# Altium project mppt-ng controlboard.PRJPCB
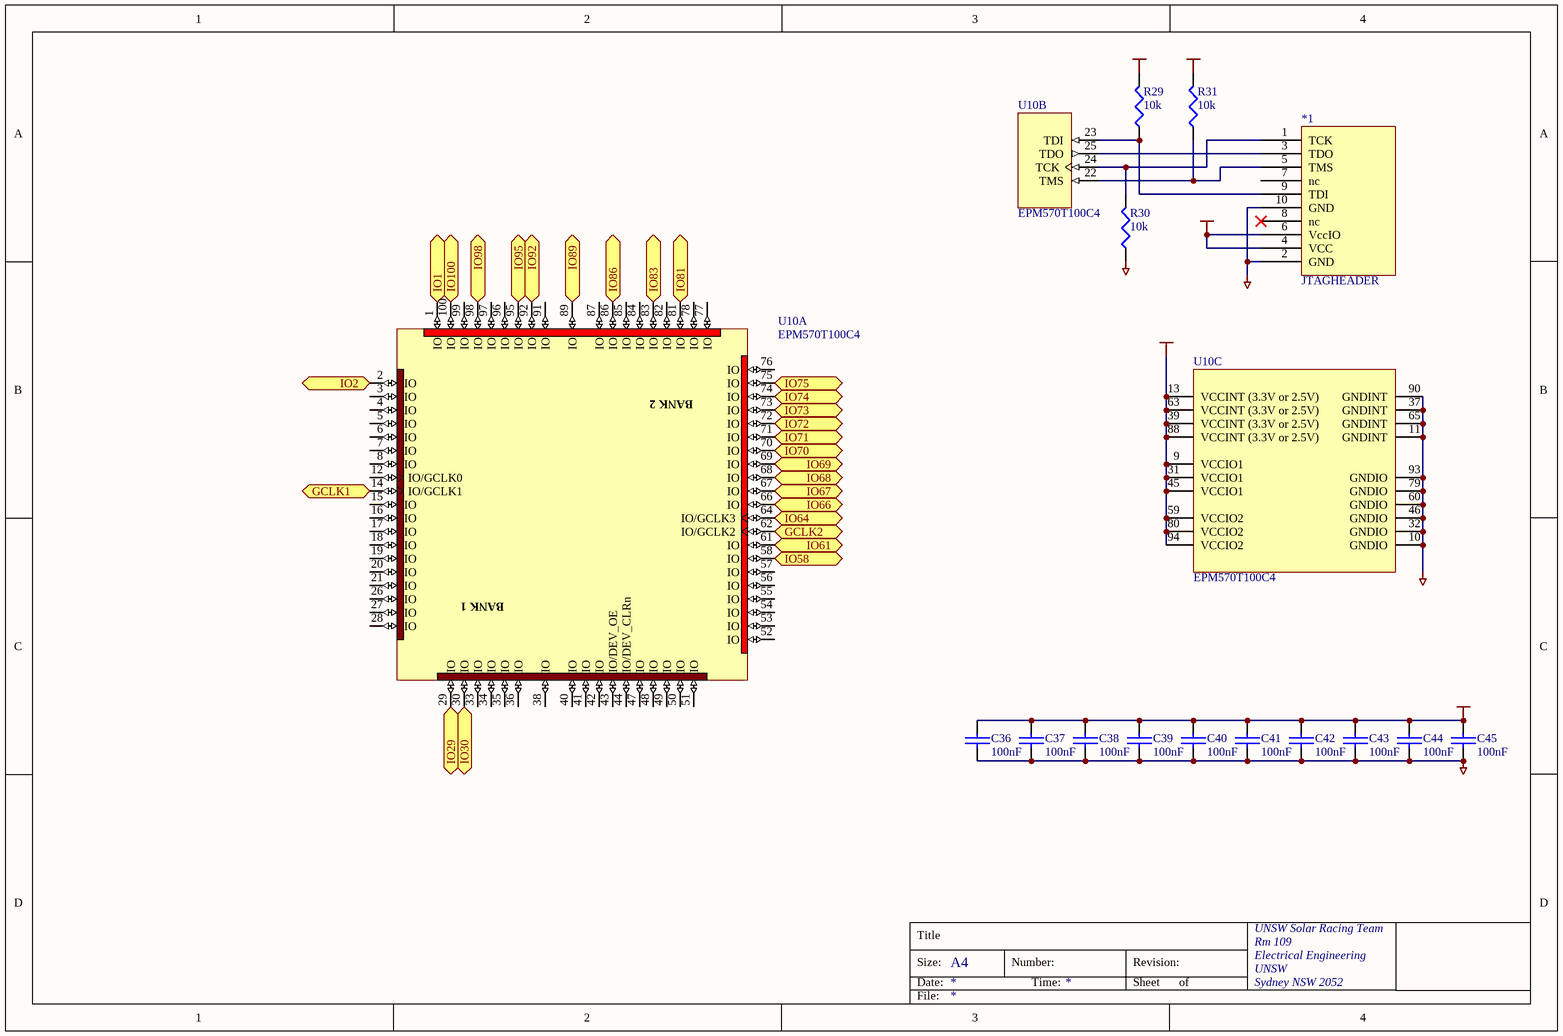
[diagram p0: MAXII.SCHDOC]
4 sheets, 61 parts. Net scope: hierarchical (ports join the sheet entries above them; power ports are global).
Board file: mppt-ng controlboard.PCBDOC
Sheets:
  MAXII.SCHDOC
  MSP430F149.SCHDOC
  3V3SwitchingRegulator.SchDoc
  3V3-CAN.SchDoc

## Sheet MAXII.SCHDOC
size A4; Organization: UNSW Solar Racing Team; Address3: UNSW; Address4: Sydney NSW 2052; Address2: Electrical Engineering; Address1: Rm 109

### Parts
*1  JTAGHEADER  [HDR2X5]
C36  100nF  [0603]
C37  100nF  [0603]
C38  100nF  [0603]
C39  100nF  [0603]
C40  100nF  [0603]
C41  100nF  [0603]
C42  100nF  [0603]
C43  100nF  [0603]
C44  100nF  [0603]
C45  100nF  [0603]
R29  10k  [0603]
R30  10k  [0603]
R31  10k  [0603]
U10  EPM570T100C4  [TQFP100]  (parts A,B,C of 3)

### Ports
GCLK1 (in), GCLK2 (in), IO1, IO2, IO29, IO30, IO58 (in), IO61, IO64 (in), IO66, IO67, IO68, IO69, IO70, IO71, IO72, IO73, IO74, IO75, IO81, IO83, IO86, IO89, IO92, IO95, IO98, IO100

### Nets
3V3: *1.4(VCC) *1.6(VccIO) C36.1 C37.1 C38.1 C39.1 C40.1 C41.1 C42.1 C43.1 C44.1 C45.1 R29.2 R31.2 U10.9(VCCIO1) U10.13(VCCINT_(3.3V_or_2.5V)) U10.31(VCCIO1) U10.39(VCCINT_(3.3V_or_2.5V)) U10.45(VCCIO1) U10.59(VCCIO2) U10.63(VCCINT_(3.3V_or_2.5V)) U10.80(VCCIO2) U10.88(VCCINT_(3.3V_or_2.5V)) U10.94(VCCIO2)
GND: *1.2(GND) *1.10(GND) C36.2 C37.2 C38.2 C39.2 C40.2 C41.2 C42.2 C43.2 C44.2 C45.2 R30.1 U10.10(GNDIO) U10.11(GNDINT) U10.32(GNDIO) U10.37(GNDINT) U10.46(GNDIO) U10.60(GNDIO) U10.65(GNDINT) U10.79(GNDIO) U10.90(GNDINT) U10.93(GNDIO)
Net*1_1: *1.1(TCK) R30.2 U10.24(TCK)
Net*1_3: *1.3(TDO) U10.25(TDO)
Net*1_5: *1.5(TMS) R31.1 U10.22(TMS)
Net*1_9: *1.9(TDI) R29.1 U10.23(TDI)
NetU10_1: U10.1(IO) ; port IO1
NetU10_2: U10.2(IO) ; port IO2
NetU10_14: U10.14(IO/GCLK1) ; port GCLK1
NetU10_29: U10.29(IO) ; port IO29
NetU10_30: U10.30(IO) ; port IO30
NetU10_58: U10.58(IO) ; port IO58
NetU10_61: U10.61(IO) ; port IO61
NetU10_62: U10.62(IO/GCLK2) ; port GCLK2
NetU10_64: U10.64(IO/GCLK3) ; port IO64
NetU10_66: U10.66(IO) ; port IO66
NetU10_67: U10.67(IO) ; port IO67
NetU10_68: U10.68(IO) ; port IO68
NetU10_69: U10.69(IO) ; port IO69
NetU10_70: U10.70(IO) ; port IO70
NetU10_71: U10.71(IO) ; port IO71
NetU10_72: U10.72(IO) ; port IO72
NetU10_73: U10.73(IO) ; port IO73
NetU10_74: U10.74(IO) ; port IO74
NetU10_75: U10.75(IO) ; port IO75
NetU10_81: U10.81(IO) ; port IO81
NetU10_83: U10.83(IO) ; port IO83
NetU10_86: U10.86(IO) ; port IO86
NetU10_89: U10.89(IO) ; port IO89
NetU10_92: U10.92(IO) ; port IO92
NetU10_95: U10.95(IO) ; port IO95
NetU10_98: U10.98(IO) ; port IO98
NetU10_100: U10.100(IO) ; port IO100

Not connected (* = marked no-connect by the designer): *1 7(nc) 8(nc)*; U10 3(IO) 4(IO) 5(IO) 6(IO) 7(IO) 8(IO) 12(IO/GCLK0) 15(IO) 16(IO) 17(IO) 18(IO) 19(IO) 20(IO) 21(IO) 26(IO) 27(IO) 28(IO) 33(IO) 34(IO) 35(IO) 36(IO) 38(IO) 40(IO) 41(IO) 42(IO) 43(IO/DEV_OE) 44(IO/DEV_CLRn) 47(IO) 48(IO) 49(IO) 50(IO) 51(IO) 52(IO) 53(IO) 54(IO) 55(IO) 56(IO) 57(IO) 76(IO) 77(IO) 78(IO) 82(IO) 84(IO) 85(IO) 87(IO) 91(IO) 96(IO) 97(IO) 99(IO)

### Notes on the sheet
- Title
- Size:
- Date:
- A4
- Number:
- Time:
- Revision:
- Sheet
- of
- File:
- (in symbol EPM570T100C4, part A) BANK 2; BANK 1

### Library data of the parts
C36-C45 = CAP: Capacitor; Farnell: 753-567; Price: 0.30
R29-R31 = RES1: Resistor; Farnell: 612-601; Price: 0.11
U10 = EPM570T100C4: MAX II 2.5/3.3V FPGA, 76 I/Os, 100-Pin Plastic TQFP, Commercial Temperature, Speed Grade 4; Note: Each set of VCCIO pins can be connected to 3.3V, 2.5V, 1.8V, or 1.5V.; Published: 15-Jul-2004; DatasheetDocument: ver1.1, Jun-2004; PackageDocument: Mar-2004; PackageReference: TQFP100; Publisher: Altium Limited; Code_JEDEC: MS-026-BDE; Code_IPC: SQFP14X14-100; Farnell: NA
*1 = JTAGHEADER: Farnell: 302-1439; Price: 2.19

## Sheet MSP430F149.SCHDOC
size A4; Organization: UNSW Solar Racing Team; Address3: UNSW; Address4: Sydney NSW 2052; Address2: Electrical Engineering; Address1: Rm 109
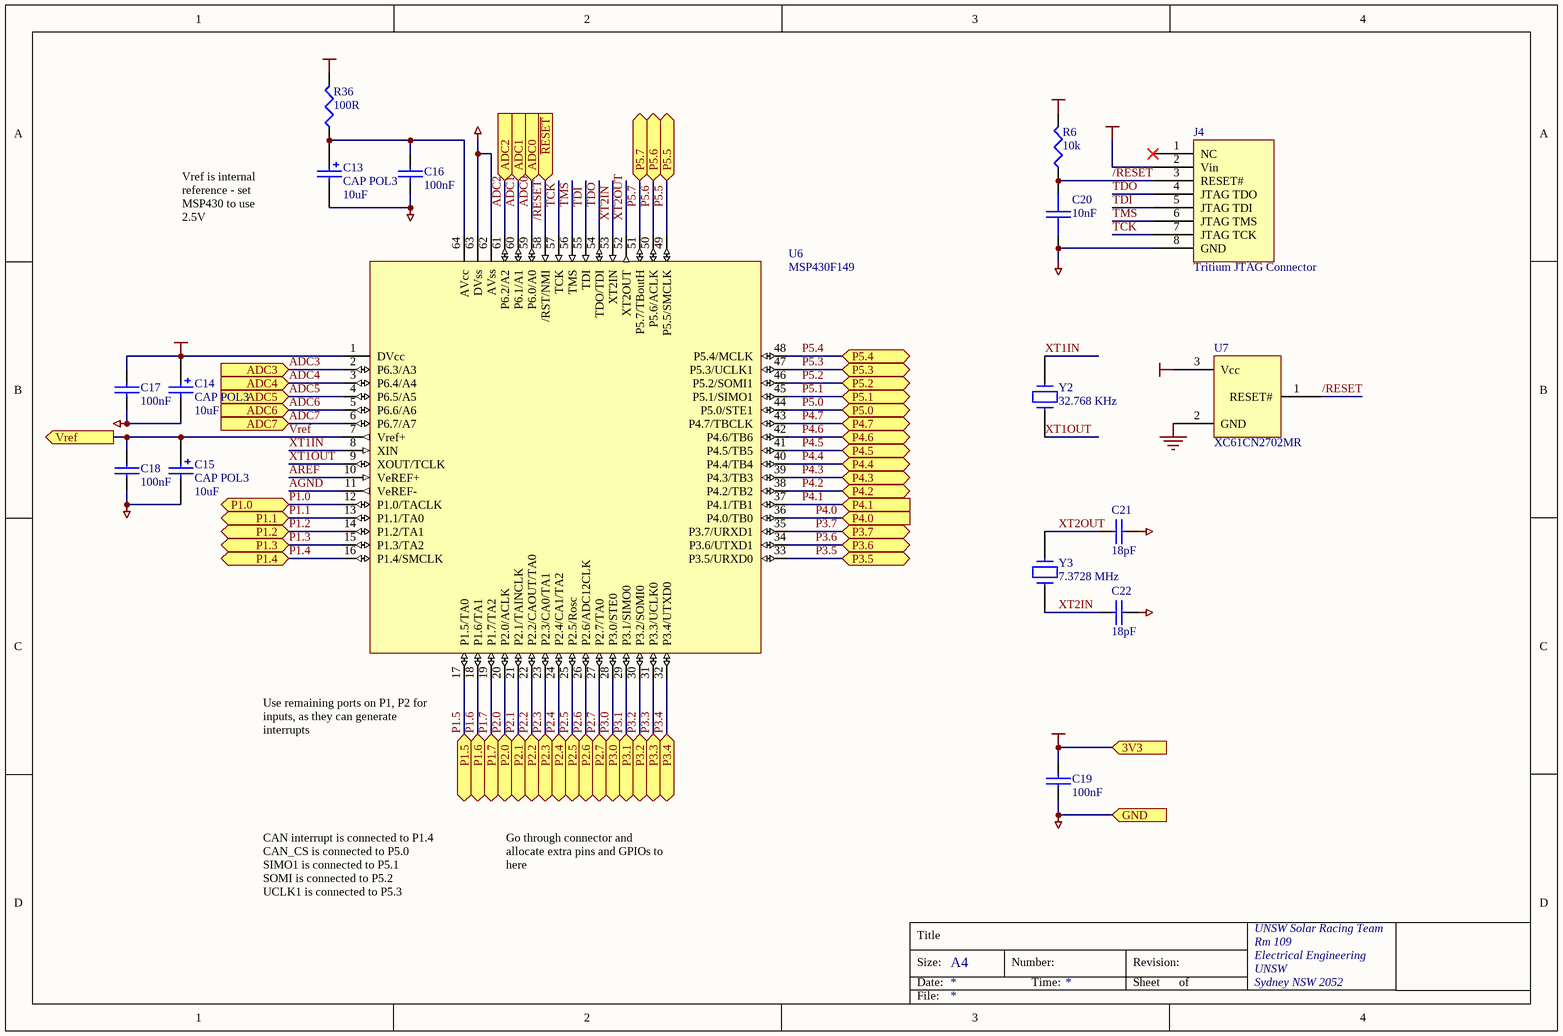
[diagram p1: MSP430F149.SCHDOC]

### Parts
C13  CAP POL3  value 10uF  [MCCT-CASEA]
C14  CAP POL3  value 10uF  [MCCT-CASEA]
C15  CAP POL3  value 10uF  [MCCT-CASEA]
C16  100nF  [0603]
C17  100nF  [0603]
C18  100nF  [0603]
C19  100nF  [0603]
C20  10nF  [0603]
C21  18pF  [0603]
C22  18pF  [0603]
J4  Tritium JTAG Connector  [HDR2X5]
R6  10k  [0603]
R36  100R  [0603]
U6  MSP430F149  [QFP64]
U7  XC61CN2702MR  [SOT23-3]
Y2  32.768 KHz  [WATCHA]
Y3  7.3728 MHz  [HC49/4H]

### Ports
3V3, ADC0 (in), ADC1 (in), ADC2 (in), ADC3 (in), ADC4 (in), ADC5 (in), ADC6 (in), ADC7 (in), GND, P1.0, P1.1, P1.2, P1.3, P1.4, P1.5, P1.6, P1.7, P2.0, P2.1, P2.2, P2.3, P2.4, P2.5, P2.6, P2.7, P3.0, P3.1, P3.2, P3.3, P3.4, P3.5, P3.6, P3.7, P4.0 (in), P4.1 (in), P4.2, P4.3, P4.4, P4.5, P4.6, P4.7, P5.0, P5.1, P5.2, P5.3, P5.4, P5.5, P5.6, P5.7, Vref (out), ~{RESET} (in)

### Nets
3V3: C14.1 C17.1 C19.1 J4.2(Vin) R6.2 R36.2 U6.1(DVcc) U7.3(Vcc) ; port 3V3
GND: C13.2 C14.2 C15.2 C16.2 C17.2 C18.2 C19.2 C20.2 C21.2 C22.2 J4.8(GND) U6.62(AVss) U6.63(DVss) U7.2(GND) ; port GND
/RESET: C20.1 J4.3(RESET#) R6.1 U6.58(/RST/NMI) U7.1(RESET#) ; port ~{RESET}
ADC0: U6.59(P6.0/A0) ; port ADC0
ADC1: U6.60(P6.1/A1) ; port ADC1
ADC2: U6.61(P6.2/A2) ; port ADC2
ADC3: U6.2(P6.3/A3) ; port ADC3
ADC4: U6.3(P6.4/A4) ; port ADC4
ADC5: U6.4(P6.5/A5) ; port ADC5
ADC6: U6.5(P6.6/A6) ; port ADC6
ADC7: U6.6(P6.7/A7) ; port ADC7
AGND: U6.11(VeREF-)
AREF: U6.10(VeREF+)
P1.0: U6.12(P1.0/TACLK) ; port P1.0
P1.1: U6.13(P1.1/TA0) ; port P1.1
P1.2: U6.14(P1.2/TA1) ; port P1.2
P1.3: U6.15(P1.3/TA2) ; port P1.3
P1.4: U6.16(P1.4/SMCLK) ; port P1.4
P1.5: U6.17(P1.5/TA0) ; port P1.5
P1.6: U6.18(P1.6/TA1) ; port P1.6
P1.7: U6.19(P1.7/TA2) ; port P1.7
P2.0: U6.20(P2.0/ACLK) ; port P2.0
P2.1: U6.21(P2.1/TAINCLK) ; port P2.1
P2.2: U6.22(P2.2/CAOUT/TA0) ; port P2.2
P2.3: U6.23(P2.3/CA0/TA1) ; port P2.3
P2.4: U6.24(P2.4/CA1/TA2) ; port P2.4
P2.5: U6.25(P2.5/Rosc) ; port P2.5
P2.6: U6.26(P2.6/ADC12CLK) ; port P2.6
P2.7: U6.27(P2.7/TA0) ; port P2.7
P3.0: U6.28(P3.0/STE0) ; port P3.0
P3.1: U6.29(P3.1/SIMO0) ; port P3.1
P3.2: U6.30(P3.2/SOMI0) ; port P3.2
P3.3: U6.31(P3.3/UCLK0) ; port P3.3
P3.4: U6.32(P3.4/UTXD0) ; port P3.4
P3.5: U6.33(P3.5/URXD0) ; port P3.5
P3.6: U6.34(P3.6/UTXD1) ; port P3.6
P3.7: U6.35(P3.7/URXD1) ; port P3.7
P4.0: U6.36(P4.0/TB0) ; port P4.0
P4.1: U6.37(P4.1/TB1) ; port P4.1
P4.2: U6.38(P4.2/TB2) ; port P4.2
P4.3: U6.39(P4.3/TB3) ; port P4.3
P4.4: U6.40(P4.4/TB4) ; port P4.4
P4.5: U6.41(P4.5/TB5) ; port P4.5
P4.6: U6.42(P4.6/TB6) ; port P4.6
P4.7: U6.43(P4.7/TBCLK) ; port P4.7
P5.0: U6.44(P5.0/STE1) ; port P5.0
P5.1: U6.45(P5.1/SIMO1) ; port P5.1
P5.2: U6.46(P5.2/SOMI1) ; port P5.2
P5.3: U6.47(P5.3/UCLK1) ; port P5.3
P5.4: U6.48(P5.4/MCLK) ; port P5.4
P5.5: U6.49(P5.5/SMCLK) ; port P5.5
P5.6: U6.50(P5.6/ACLK) ; port P5.6
P5.7: U6.51(P5.7/TBoutH) ; port P5.7
TCK: J4.7(JTAG_TCK) U6.57(TCK)
TDI: J4.5(JTAG_TDI) U6.55(TDI)
TDO: J4.4(JTAG_TDO) U6.54(TDO/TDI)
TMS: J4.6(JTAG_TMS) U6.56(TMS)
Vref: C15.1 C18.1 U6.7(Vref+) ; port Vref
XT1IN: U6.8(XIN) Y2.1
XT1OUT: U6.9(XOUT/TCLK) Y2.2
XT2IN: C22.1 U6.53(XT2IN) Y3.1
XT2OUT: C21.1 U6.52(XT2OUT) Y3.2
NetC13_1: C13.1 C16.1 R36.1 U6.64(AVcc)

Not connected (* = marked no-connect by the designer): J4 1(NC)*

### Notes on the sheet
- Vref is internal reference - set MSP430 to use 2.5V
- (near U6) Use remaining ports on P1, P2 for inputs, as they can generate interrupts
- CAN interrupt is connected to P1.4
  CAN_CS is connected to P5.0
  SIMO1 is connected to P5.1
  SOMI is connected to P5.2
  UCLK1 is connected to P5.3
- Go through connector and allocate extra pins and GPIOs to here
- Title
- Size:
- Date:
- A4
- Number:
- Time:
- Revision:
- Sheet
- of
- File:

### Library data of the parts
C13-C15 = CAP POL3: Polarized Capacitor (Surface Mount); Manufacturer: Generic Components; Class I: Passive; Published: 8-Jun-2000; Revision: July-2002: Re-released for DXP Platform.; Publisher: Altium Limited; Class II: Capacitor; Farnell: 967-014; Price: 1.06
C16-C22 = CAP: Capacitor
  C16-C19: Farnell: 753-567; Price: 0.30
  C20: Farnell: 722-236; Price: 0.11
  C21 C22: Farnell: 721-992; Price: 0.10
J4 = 430F_JTAG_TRITIUM: Tritium JTAG interface for MSP430; Extra parts: 672-520, 672-555; Farnell: 302-1439; Price: 2.19
R6 R36 = RES1: Resistor; Price: 0.11
  R6: Farnell: 612-601
  R36: Farnell: 612-364
U6 = MSP430F14X: Farnell: NA
U7 = XC61F: SOT23 reset generator; Farnell: 360-5504; Price: 1.80
Y2 Y3 = CRYSTAL
  Y2: Farnell: 569-914; Price: 2.22
  Y3: Farnell: 485-111; Price: 3.38

## Sheet 3V3SwitchingRegulator.SchDoc: 3.3V Switching Regulator
size A4; Organization: UNSW Solar Racing Team; Address3: UNSW; Address4: Sydney NSW 2052; Address2: Electrical Engineering; Address1: Rm 109
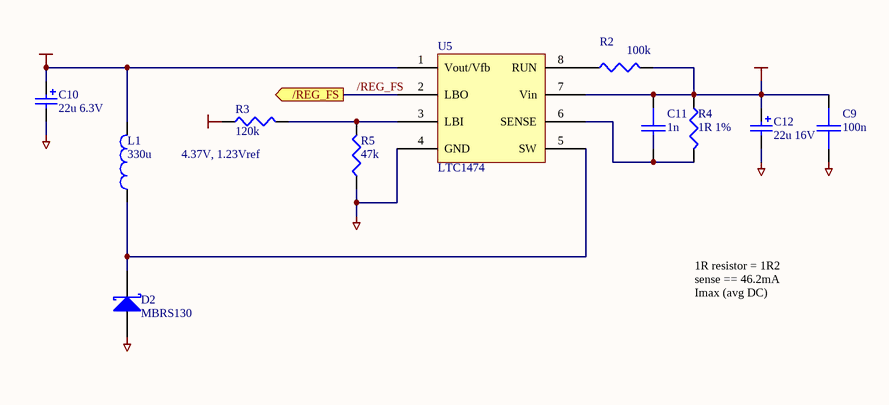
[diagram p2: 3V3SwitchingRegulator.SchDoc]

### Parts
C9  100n  [0603]
C10  22u 6.3V  [MCCT-CASEC]
C11  1n  [0603]
C12  22u 16V  [MCCT-CASEC]
D2  MBRS130  [SMB]
L1  330u  [1812]
R2  100k  [0603]
R3  120k  [0603]
R4  1R 1%  [0603]
R5  47k  [0603]
U5  LTC1474  [TSOP8]

### Ports
/REG_FS (out)

### Nets
3V3: C10.1 L1.2 U5.1(Vout/Vfb)
5V: C9.1 C11.1 C12.1 R2.2 R3.1 R4.1 U5.7(Vin)
GND: C9.2 C10.2 C12.2 D2.A R5.1 U5.4(GND)
/REG_FS: U5.2(LBO) ; port /REG_FS
NetC11_2: C11.2 R4.2 U5.6(SENSE)
NetD2_K: D2.K L1.1 U5.5(SW)
NetR2_1: R2.1 U5.8(RUN)
NetR3_2: R3.2 R5.2 U5.3(LBI)

### Notes on the sheet
- (near R3) 4.37V, 1.23Vref
- 1R resistor = 1R2 sense == 46.2mA Imax (avg DC)
- Title
- Size:
- Date:
- A4
- Number:
- Time:
- Revision:
- Sheet
- of
- File:

### Library data of the parts
C9 = CAP: Capacitor; Manufacturer: Generic Components; Class I: Passive; Value: 0.1uF; Published: 8-Jun-2000; Revision: July-2002: Re-released for DXP Platform.; Publisher: Altium Limited; Class II: Capacitor; Farnell: 753-567; Price: 0.30
C10 C12 = Cap Pol3: Polarized Capacitor (Surface Mount); Manufacturer: Generic Components; Class I: Passive; Value: 22uF; Published: 8-Jun-2000; Revision: July-2002: Re-released for DXP Platform.; Publisher: Altium Limited; Class II: Capacitor; Price: 2.14
  C10: Farnell: 967-026
  C12: Farnell: 967-129
C11 = CAP: Capacitor; Manufacturer: Generic Components; Class I: Passive; Value: 1nF; Published: 8-Jun-2000; Revision: July-2002: Re-released for DXP Platform.; Publisher: Altium Limited; Class II: Capacitor; Farnell: 753-580; Price: 0.13
D2 = D SCHOTTKY: Schottky Diode; Manufacturer: Generic Components; Class I: Discrete; Class II: Diode - Schottky; Published: 8-Jun-2000; Revision: July-2002: Re-released for DXP Platform.; Publisher: Altium Limited; Farnell: 708-150; Price: 1.47
L1 = Inductor: Manufacturer: Generic Components; Class I: Passive; Value: 330uH; Published: 8-Jun-2000; Revision: July-2002: Re-released for DXP Platform.; Publisher: Altium Limited; Class II: Inductor; Farnell: 200-451; Price: 3.02
R2 R5 = RES1: Resistor
  R2: Farnell: 612-728; Price: 0.11
  R5: Farnell: 360-2771; Price: 0.15
R3 = Res1: Resistor; Farnell: 3602825; Price: 0.15
R4 = RES1: Resistor; Manufacturer: Generic Components; Class I: Passive; Published: 8-Jun-2000; Revision: July-2002: Re-released for DXP Platform.; Publisher: Altium Limited; Class II: Resistor; Value: 1R; Farnell: 360-2217; Price: 0.15
U5 = LTC1474: Step-down converter, LTC1474CMS8-3.3; Order: Order from LTC website (4.60USD); Farnell: NA

## Sheet 3V3-CAN.SchDoc
size A4; Organization: UNSW Solar Racing Team; Address3: UNSW; Address4: Sydney NSW 2052; Address2: Electrical Engineering; Address1: Rm 109
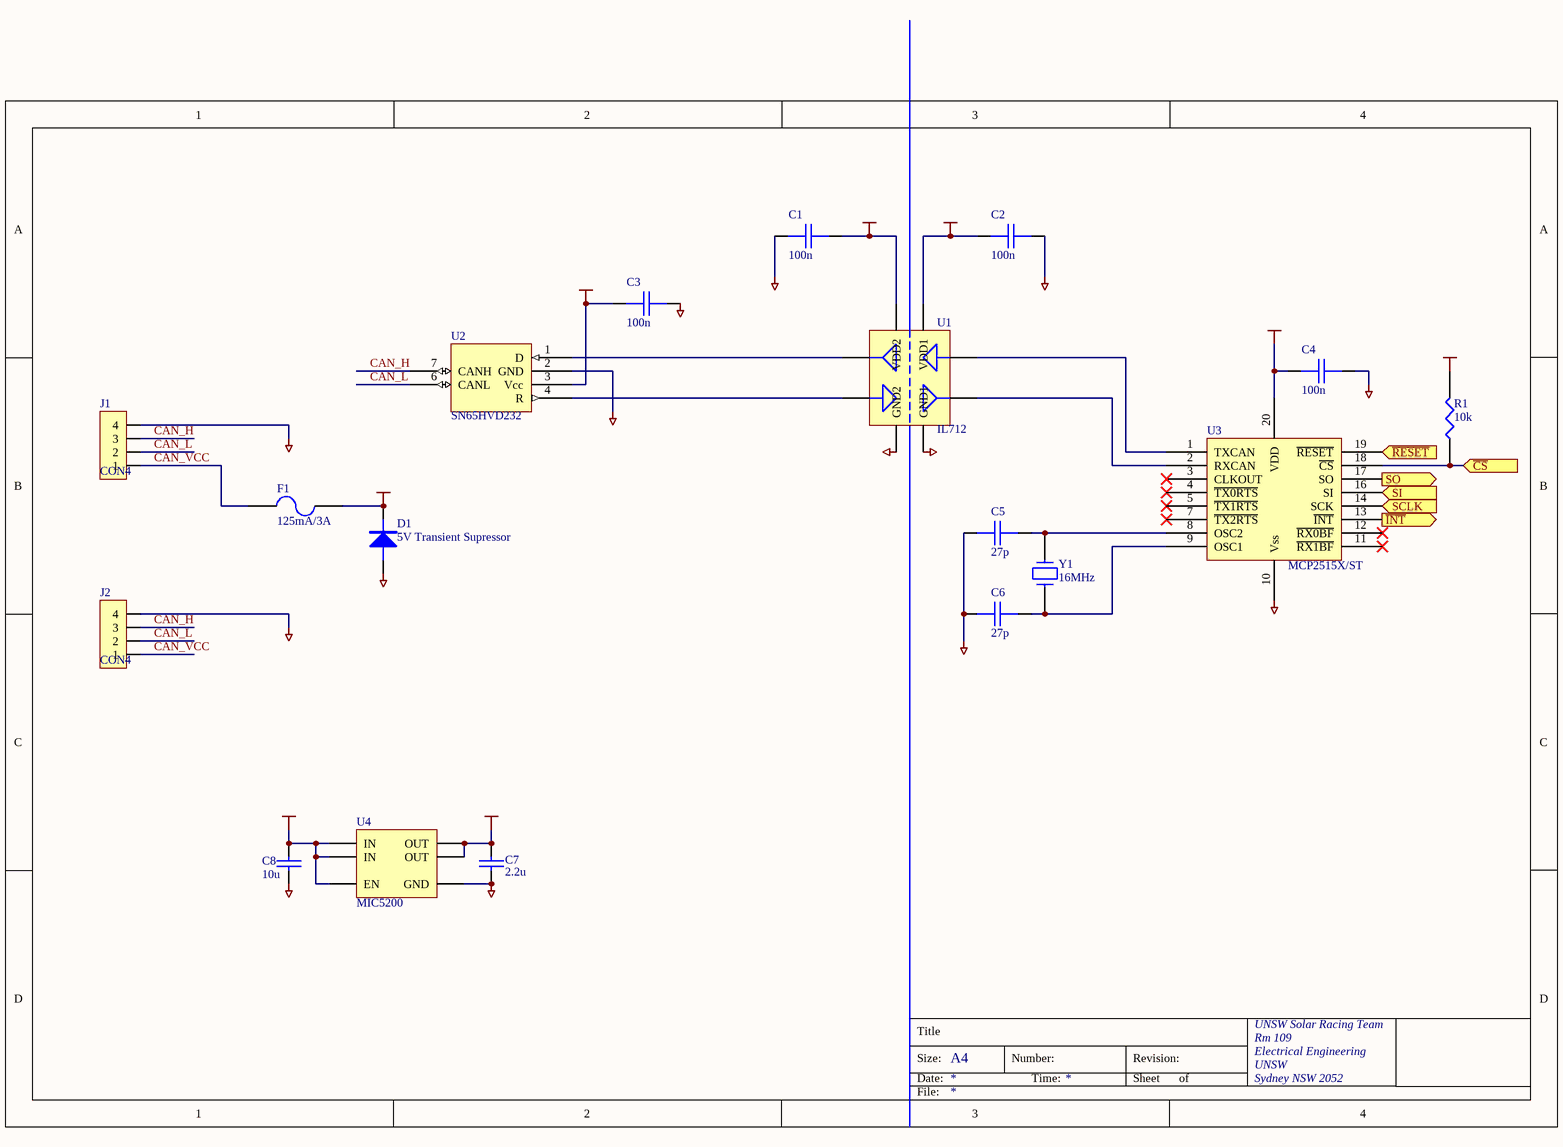
[diagram p3: 3V3-CAN.SchDoc]

### Parts
C1  100n  [0603]
C2  100n  [0603]
C3  100n  [0603]
C4  100n  [0603]
C5  27p  [0603]
C6  27p  [0603]
C7  2.2u  [MCCT-CASEA]
C8  10u  [MCCT-CASEB]
D1  5V Transient Supressor  [SMA]
F1  125mA/3A  [LITTELFUSE-154]
J1  CON4  [WEIDMULLER-SL3.5/4/90G]
J2  CON4  [WEIDMULLER-SL3.5/4/90G]
R1  10k  [0603]
U1  IL712  [SO8]
U2  SN65HVD232  [SO8]
U3  MCP2515X/ST  [TSSOP20]
U4  MIC5200  [SO8]
Y1  16MHz  [HC49/4H]

### Ports
SCLK (in), SI (in), SO (out), ~{CS} (in), ~{INT} (out), ~{RESET} (in)

### Nets
3V3: C2.2 C4.1 R1.2 U1.1(VDD1) U3.20(VDD)
CAN_3V3: C1.2 C3.2 C7.2 U1.8(VDD2) U2.3(Vcc) U4.1(OUT) U4.2(OUT)
CAN_5V: C8.1 D1.K F1.2 U4.5(EN) U4.7(IN) U4.8(IN)
CAN_GND: C1.1 C3.1 C7.1 C8.2 D1.A J1.4 J2.4 U1.5(GND2) U2.2(GND) U4.4(GND)
GND: C2.1 C4.2 C5.1 C6.1 U1.4(GND1) U3.10(Vss)
CAN_H: J1.3 J2.3 U2.7(CANH)
CAN_L: J1.2 J2.2 U2.6(CANL)
CAN_VCC: F1.1 J1.1 J2.1
NetC5_2: C5.2 U3.8(OSC2) Y1.1
NetC6_2: C6.2 U3.9(OSC1) Y1.2
NetR1_1: R1.1 U3.18(~{CS}) ; port ~{CS}
NetU1_2: U1.2(IN1) U3.1(TXCAN)
NetU1_3: U1.3(OUT2) U3.2(RXCAN)
NetU1_6: U1.6(IN2) U2.4(R)
NetU1_7: U1.7(OUT1) U2.1(D)
NetU3_13: U3.13(~{INT}) ; port ~{INT}
NetU3_14: U3.14(SCK) ; port SCLK
NetU3_16: U3.16(SI) ; port SI
NetU3_17: U3.17(SO) ; port SO
NetU3_19: U3.19(~{RESET}) ; port ~{RESET}

Not connected (* = marked no-connect by the designer): U3 3(CLKOUT)* 4(~{TX0RTS})* 5(~{TX1RTS})* 7(~{TX2RTS})* 11(~{RX1BF})* 12(~{RX0BF})*

### Notes on the sheet
- Title
- Size:
- Date:
- A4
- Number:
- Time:
- Revision:
- Sheet
- of
- File:

### Library data of the parts
C1 C2 C4 = CAP: Capacitor; something: 0.31; note: Purchase a reel.; Farnell: 753-567; Price: 0.30
C3 = CAP: Capacitor; something: 0.31; Note: Purchase a reel.; Farnell: 753-567; Price: 0.30
C5 C6 C8 = CAP: Capacitor
  C5 C6: Farnell - 15pF: 721-980; Farnell: 722-017; Price: 0.30
  C8: Farnell: 967-117; Price: 1.45
C7 = CAP: Capacitor; Something: 0.938; Farnell: 967-099; Supplier: Farnell.; Price: 0.938
D1 = DIODE
F1 = FUSE2: Fuse; value: 154-375T (Holder + 125mA fuse) AND 0454 003 (3A Fuse); website: www.littelfuse.com; Farnell: 664-819; Price: 7.87
J1 J2 = CON4: Connector; Farnell: 617-477; Price: 2.05
R1 = RES1: Farnell: 612-601; Price: 0.11
U1 = IL712: IL712 Optoisolator - www.nve.com; Part Field 2: 12.00; Part Field 3: Trade Tech - IL712-3; Part Field 4: simon.cope@tradetech.co.nz; Farnell: NA
U2 = SN65HVD232: 3.3V CAN Transciever; Part Field 2: 5.00; Part Field 3: www.ti.com - Texas Instruments; Farnell: NA
U3 = MCP2515X/ST: MCP2510 CAN Controller; Farnell: NA
U4 = MIC5200: MIC5200 - SO8; Part Field 2: 2.00; Part Field 3: Computer Science and Engineering; Part Field 4: David Johnson; Farnell: 572-111; Price: 10.72
Y1 = CRYSTAL: Farnell SMD: 639-588; Farnell: 485-093; Price: 2.61

## Nets that join several sheets
3V3: MAXII (24 pins), MSP430F149 (8 pins), 3V3SwitchingRegulator (C10.1 L1.2 U5.1), 3V3-CAN (5 pins)
GND: MAXII (23 pins), MSP430F149 (14 pins), 3V3SwitchingRegulator (6 pins), 3V3-CAN (6 pins)